# EAGLE schematic TempSetUP_V1 v2 (EAGLE 9.7.0)
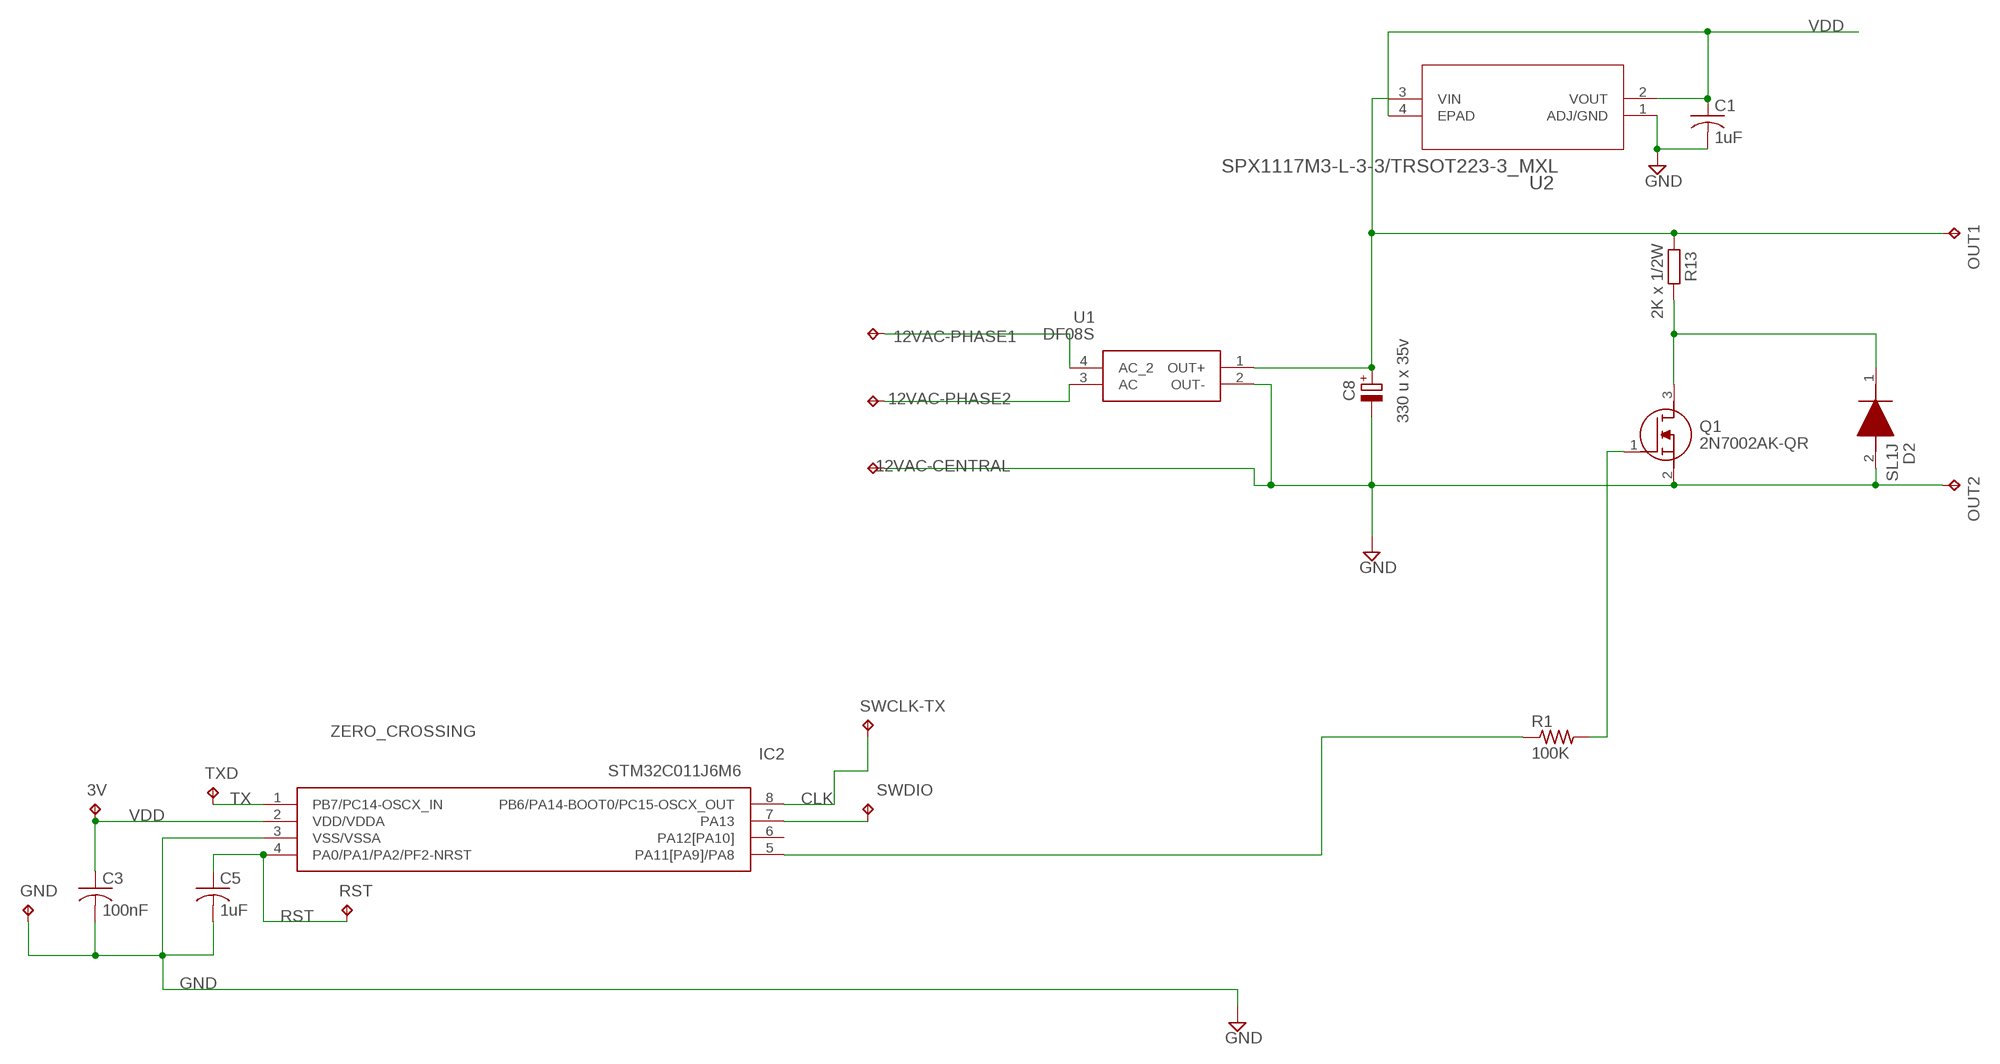
[diagram p0: schematic, sheet 1]

## Parts
3V  TPB1,27  [B1,27]
12VAC-CENTRAL  TPPAD1-13  [P1-13]
12VAC-PHASE1  TPPAD1-13  [P1-13]
12VAC-PHASE2  TPPAD1-13  [P1-13]
C1  1uF  C-US_CHIP-0805(2012-METRIC)  [CAPC2012X110]
C3  100nF  C-US_CHIP-0805(2012-METRIC)  [CAPC2012X110]
C5  1uF  C-US_CHIP-0805(2012-METRIC)  [CAPC2012X110]
C8  330 u x 35v  CAPACITOR-POLRADIAL-5MM-DIA  [CAPPRD254W65D500H1150B]
D2  SL1J  [SODFL3718X130N]
GND  G1  TPB1,27  [B1,27]
IC2  STM32C011J6M6  [SOIC127P600X175-8N]
OUT1  TPPAD1-13  [P1-13]
OUT2  TPPAD1-13  [P1-13]
Q1  2N7002AK-QR  [SOT95P230X110-3N]
R1  100K  R-US_CHIP-0805(2012-METRIC)  [RESC2012X65]
R13  2K x 1/2W  R_CHIP-0805(2012-METRIC)  [RESC2012X65]
RST  TPB1,27  [B1,27]
SWCLK-TX  TPB1,27  [B1,27]
SWDIO  TPB1,27  [B1,27]
TXD  TPB1,27  [B1,27]
U1  DF08S  [SOT508P985X260-4N]
U2  SPX1117M3-L-3-3/TRSOT223-3_MXL  [SOT223-3_MXL]

## Nets
CLK: IC2.8(PB6/PA14-BOOT0/PC15-OSCX_OUT) SWCLK-TX.TP
GND: 12VAC-CENTRAL.TP C1.2 C3.2 C5.2 C8.2(-) D2.2(A) GND.TP IC2.3(VSS/VSSA) OUT2.TP Q1.2(S) U1.2(OUT-) U2.1(ADJ/GND)
N$1: 12VAC-PHASE1.TP U1.4(AC_2)
N$2: D2.1(K) Q1.3(D) R13.2
N$3: C8.1(+) OUT1.TP R13.1 U1.1(OUT+) U2.3(VIN)
N$4: 12VAC-PHASE2.TP U1.3(AC)
N$5: Q1.1(G) R1.2
NTC: IC2.5(PA11[PA9]/PA8) R1.1
RST: C5.1 IC2.4(PA0/PA1/PA2/PF2-NRST) RST.TP
TX: IC2.1(PB7/PC14-OSCX_IN) TXD.TP
VDD: 3V.TP C1.1 C3.1 IC2.2(VDD/VDDA) U2.2(VOUT) U2.4(EPAD)
ZERO_CROSSING: IC2.7(PA13) SWDIO.TP
Unconnected: IC2.6(PA12[PA10])

## Library data of the parts
3V 12VAC-CENTRAL 12VAC-PHASE1 12VAC-PHASE2 GND OUT1 OUT2 RST SWCLK-TX SWDIO TXD = testpad:TP: Test pad
C1 C3 C5 = Capacitor:C-US: Capacitor - ANSI; CATEGORY: Capacitor
C8 = Tinkercad:CAPACITOR-POL: Capacitor Polarised - Generic; MODEL: RPF0610102M006K
D2 = SL1J:SL1J: Rectifier Diode Switching 600V 1A 1000ns 2-Pin SOD-123FL T/R Source: Datasheet <https://diotec.com/request/datasheet/sl1a.pdf>; DESCRIPTION: Rectifier Diode Switching 600V 1A 1000ns 2-Pin SOD-123FL T/R; HEIGHT: 1.3mm; MANUFACTURER_NAME: Diotec; MANUFACTURER_PART_NUMBER: SL1J; MOUSER_PART_NUMBER: 637-SL1J; MOUSER_PRICE-STOCK: https://www.mouser.co.uk/ProductDetail/Diotec-Semiconductor/SL1J?qs=OlC7AqGiEDm%2FUyNJqMVviA%3D%3D
IC2 = STM32C011J6M6:STM32C011J6M6: Mainstream Arm Cortex-M0+ MCU with 32 Kbytes of Flash memory, 6 Kbytes RAM, 48 MHz CPU, 2x USART, timers, ADC, comm. I/F, 2-3.6V Source: Datasheet <https://www.st.com/resource/en/datasheet/stm32c011d6.pdf>; DESCRIPTION: Mainstream Arm Cortex-M0+ MCU with 32 Kbytes of Flash memory, 6 Kbytes RAM, 48 MHz CPU, 2x USART, timers, ADC, comm. I/F, 2-3.6V; HEIGHT: 1.75mm; MANUFACTURER_NAME: STMicroelectronics; MANUFACTURER_PART_NUMBER: STM32C011J6M6; MOUSER_PART_NUMBER: 511-STM32C011J6M6; MOUSER_PRICE-STOCK: https://www.mouser.co.uk/ProductDetail/STMicroelectronics/STM32C011J6M6?qs=IPgv5n7u5Qas2LaNYHG%2FbQ%3D%3D
Q1 = 2N7002AK-QR:2N7002AK-QR: N-Channel 60 V 240mA 320mW Surface Mount SOT-23-3 (TO-236) Source: Datasheet <https://assets.nexperia.com/documents/data-sheet/2N7002AK-Q.pdf>; DESCRIPTION: N-Channel 60 V 240mA 320mW Surface Mount SOT-23-3 (TO-236); HEIGHT: 1.1mm; MANUFACTURER_NAME: Nexperia; MANUFACTURER_PART_NUMBER: 2N7002AK-QR; MOUSER_PART_NUMBER: 771-2N7002AK-QR; MOUSER_PRICE-STOCK: https://www.mouser.co.uk/ProductDetail/Nexperia/2N7002AK-QR?qs=mELouGlnn3ff0hT2G%252Bqyfw%3D%3D
R1 = Tutorial - Fusion 360:R-US: Resistor Fixed - ANSI; CATEGORY: Resistor; SUB-CATEGORY: Fixed
R13 = Resistor:R: Resistor Fixed - Generic; CATEGORY: Resistor; SUB-CATEGORY: Fixed
U1 = DF08S:DF08S: DF08S, Bridge Rectifier Single Phase, 1.5A 800V, 4-Pin SDIP Source: Datasheet <http://componentsearchengine.com/Datasheets/1/DF08S.pdf>; DESCRIPTION: DF08S, Bridge Rectifier Single Phase, 1.5A 800V, 4-Pin SDIP; HEIGHT: mm; MANUFACTURER_NAME: onsemi; MANUFACTURER_PART_NUMBER: DF08S; MOUSER_PART_NUMBER: 512-DF08S; MOUSER_PRICE-STOCK: https://www.mouser.co.uk/ProductDetail/onsemi-Fairchild/DF08S?qs=Ec0VQc59F%252BlRA0XgpNiCJg%3D%3D
U2 = 2023-10-17_10-46-12_Library:SPX1117M3-L-3-3/TR; COPYRIGHT: Copyright (C) 2023 Ultra Librarian. All rights reserved.; MANUFACTURER_PART_NUMBER: SPX1117M3-L-3-3/TR; MFR_NAME: MaxLinear / Exar